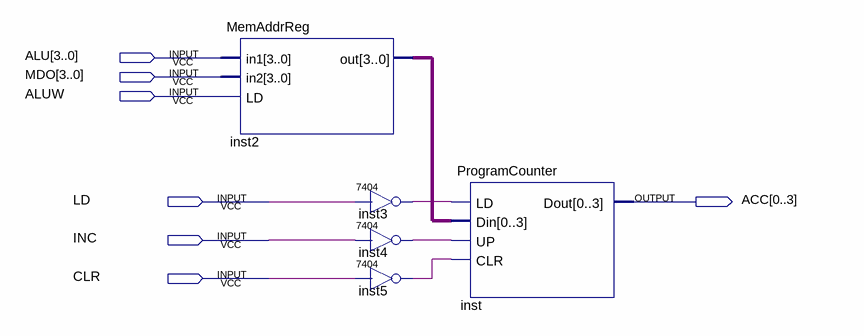
[diagram p0: schematic sheet]
// Quartus schematic Accumulator.bdf as structural Verilog: 5 symbols, 7 pins
module Accumulator (
  input  [3:0] ALU,
  input  [3:0] MDO,
  input  ALUW,
  input  LD,
  input  INC,
  input  CLR,
  output [0:3] ACC
);

  wire inst3_1, inst4_1, inst5_1;
  wire [3:0] inst2_out;

  MemAddrReg inst2 (.in1(ALU), .in2(MDO), .LD(ALUW), .out(inst2_out));
  \7404  inst3 (.\2 (LD), .\1 (inst3_1));
  \7404  inst4 (.\2 (INC), .\1 (inst4_1));
  \7404  inst5 (.\2 (CLR), .\1 (inst5_1));
  ProgramCounter inst (.LD(inst3_1), .Din(inst2_out), .UP(inst4_1), .CLR(inst5_1), .Dout(ACC));
endmodule
